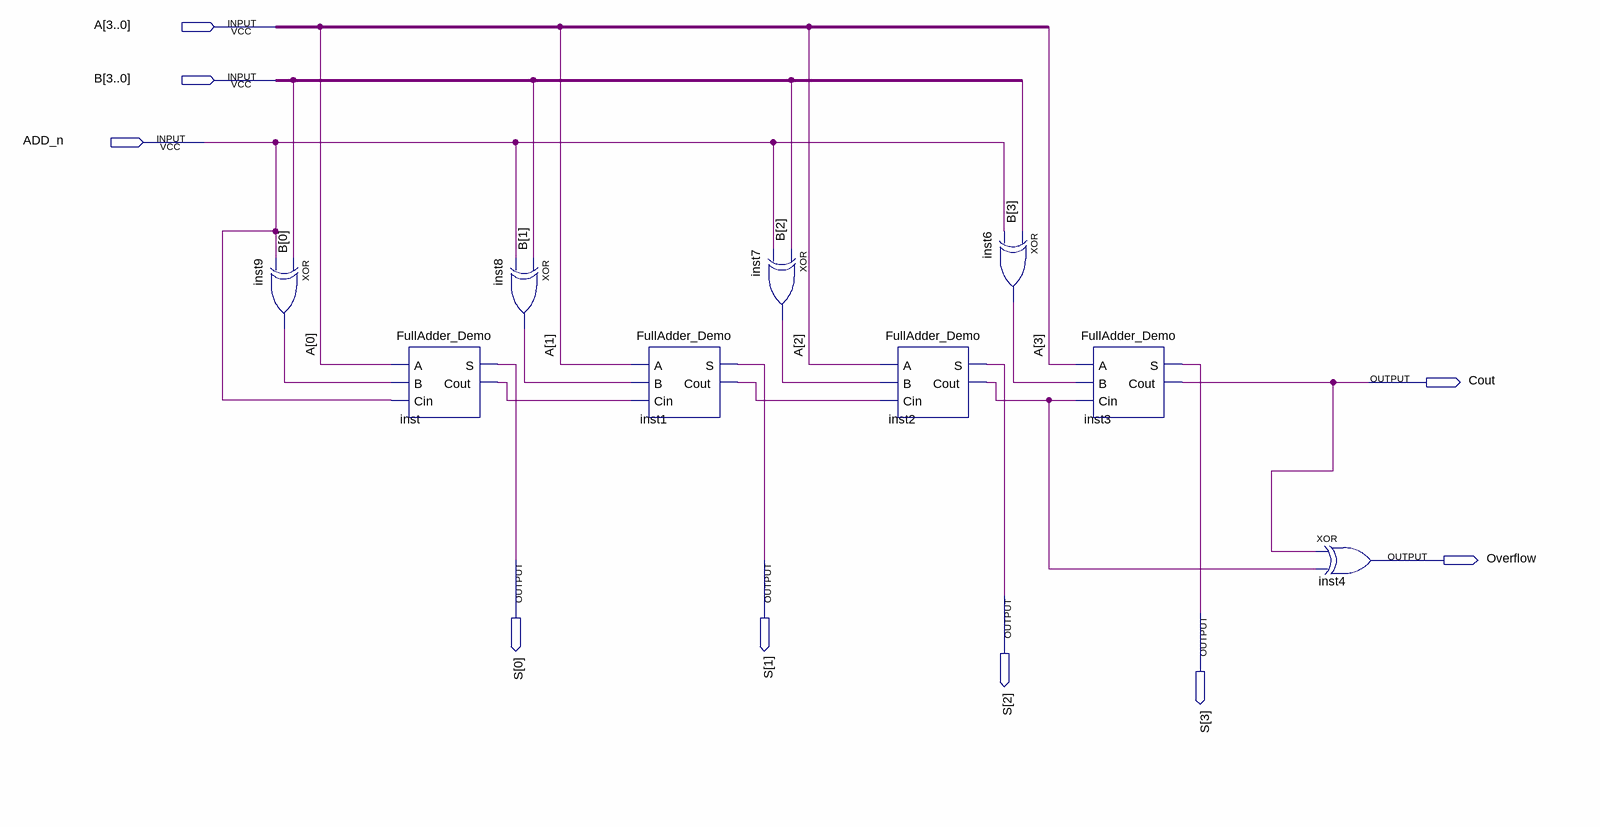
[diagram p0: schematic sheet]
// Quartus schematic bit4FullAdder.bdf as structural Verilog: 9 symbols, 9 pins
module bit4FullAdder (
  input  [3:0] A,
  input  [3:0] B,
  input  ADD_n,
  output Cout,
  output [3:0] S,
  output Overflow
);

  wire inst1_cout, inst2_cout, inst6_out, inst7_out, inst8_out, inst9_out, inst_cout;

  xor inst9 (inst9_out, B[0], ADD_n);
  FullAdder_Demo inst (.A(A[0]), .B(inst9_out), .Cin(ADD_n), .S(S[0]), .Cout(inst_cout));
  xor inst8 (inst8_out, B[1], ADD_n);
  FullAdder_Demo inst1 (.A(A[1]), .B(inst8_out), .Cin(inst_cout), .S(S[1]), .Cout(inst1_cout));
  xor inst7 (inst7_out, B[2], ADD_n);
  FullAdder_Demo inst2 (.A(A[2]), .B(inst7_out), .Cin(inst1_cout), .S(S[2]), .Cout(inst2_cout));
  xor inst6 (inst6_out, B[3], ADD_n);
  FullAdder_Demo inst3 (.A(A[3]), .B(inst6_out), .Cin(inst2_cout), .S(S[3]), .Cout(Cout));
  xor inst4 (Overflow, Cout, inst2_cout);
endmodule
